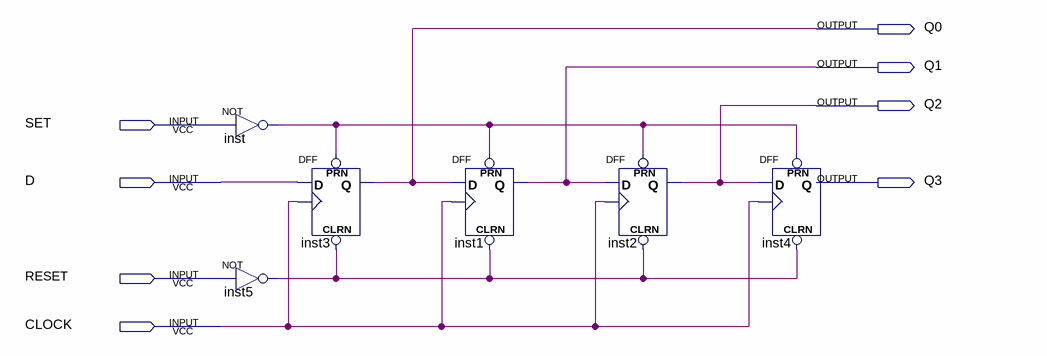
[diagram p0: schematic sheet]
// Quartus schematic example2.bdf as structural Verilog: 6 symbols, 8 pins
module example2 (
  input  SET,
  input  D,
  input  RESET,
  input  CLOCK,
  output Q0,
  output Q1,
  output Q2,
  output Q3
);

  wire inst5_out, inst_out;

  not inst (inst_out, SET);
  not inst5 (inst5_out, RESET);
  DFF inst3 (.CLRN(inst5_out), .CLK(CLOCK), .D(D), .PRN(inst_out), .Q(Q0));
  DFF inst1 (.CLRN(inst5_out), .CLK(CLOCK), .D(Q0), .PRN(inst_out), .Q(Q1));
  DFF inst2 (.CLRN(inst5_out), .CLK(CLOCK), .D(Q1), .PRN(inst_out), .Q(Q2));
  DFF inst4 (.CLRN(inst5_out), .CLK(CLOCK), .D(Q2), .PRN(inst_out), .Q(Q3));
endmodule
